# Altium schematic sheet CAN_IC.SchDoc
size A; SheetNumber: 8; SheetTotal: 8
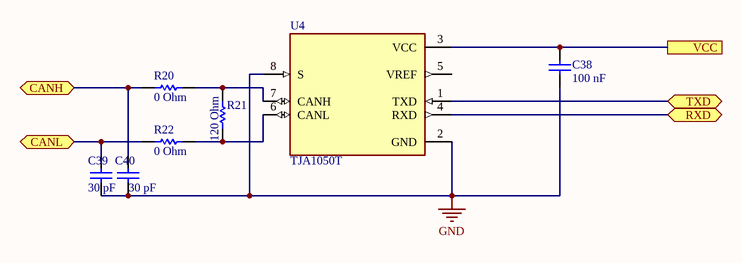
[diagram p0: CAN_IC.SchDoc]

## Parts
C38  100 nF  [CAP_0603]
C39  30 pF  [CAP_0603]
C40  30 pF  [CAP_0603]
R20  0 Ohm  [resistor_0603]
R21  120 Ohm  [resistor_0603]
R22  0 Ohm  [resistor_0603]
U4  TJA1050T  [SOIC127P600X175-8N]

## Ports
CANH (bidir, see MAIN_SENSOR[2A]), CANL (bidir, see MAIN_SENSOR[2A]), RXD (bidir, see MAIN_SENSOR[2A]), TXD (bidir, see MAIN_SENSOR[2A]), VCC (see MAIN_SENSOR[2A])

## Nets
GND: C38.2 C39.1 C40.1 U4.2(GND) U4.8(S)
CANH: C40.2 R20.1 ; port CANH
CANL: C39.2 R22.1 ; port CANL
RXD: U4.4(RXD) ; port RXD
TXD: U4.1(TXD) ; port TXD
VCC: C38.1 U4.3(VCC) ; port VCC
NetR20_2: R20.2 R21.2 U4.7(CANH)
NetR21_1: R21.1 R22.2 U4.6(CANL)

Not connected (* = marked no-connect by the designer): U4 5(VREF)

## Library data of the parts
C38 = 0106031041050: CAP, size 0603, 100 nF, 50 VDC; Manufacture Name: TDK; Manufacture SN: CGA3E3X8R1H104K080AE; Tolerance: +/-10%; Voltage Rating DC: 50 VDC; ComponentLink2Description: Datasheet; ComponentLink2URL: https://product.tdk.com/system/files/dam/doc/product/capacitor/ceramic/mlcc/catalog/mlcc_automotive_soft_en.pdf?ref_disty=mouser; Operating Temperature: -55 to +125degC; Packaging: Tape and Reel; Mounting Technology: SMT; Size: 0603; Capacitance: 100 nF; Supplier 1 Name: Mouser; Supplier 1 SN: 810-CGA3E3X8R1H104KA; Supplier 1 URL: https://www.mouser.com/ProductDetail/TDK/CGA3E3X8R1H104K080AE?qs=nQSIdc08i%252Bd8g3IRRgU2bw%3D%3D&utm_source=mouser-refine-download&utm_medium=file&utm_campaign=CGA3E3X8R1H104K080AE&utm_content=TDK; Supplier 2 Name: Digi-Key; Supplier 2 SN: 445-173697-2-ND; Supplier 2 URL: https://www.digikey.com/en/products/detail/tdk-corporation/cga3e3x8r1h104k080ae/5809262; Supplier 3 Name: thegioiic; Supplier 3 SN: N/A; Supplier 3 URL: N/A; Value: 100 nF, 50 VDC
C39 C40 = 0106033300550: CAP, size 0603, 33 pF, 50 VDC; Manufacture Name: TDK; Manufacture SN: CGA3E2NP01H330J080AA; Capacitance: 33 pF; Tolerance: +/-5%; Voltage Rating DC: 50 VDC; ComponentLink2Description: Datasheet; ComponentLink2URL: https://product.tdk.com/system/files/dam/doc/product/capacitor/ceramic/mlcc/catalog/mlcc_automotive_hightemp_en.pdf?ref_disty=mouser; Operating Temperature: -55 to +125degC; Packaging: Tape and Reel; Mounting Technology: SMT; Size: 0603; Supplier 1 Name: Mouser; Supplier 1 SN: 810-CGA3E2NP01H330JA; Supplier 1 URL: https://www.mouser.com/ProductDetail/TDK/CGA3E2NP01H330J080AA?qs=xLDY6iXSiQZLs28ZlT4aFg%3D%3D&utm_source=mouser-refine-download&utm_medium=file&utm_campaign=CGA3E2NP01H330J080AA&utm_content=TDK; Supplier 2 Name: Digi-Key; Supplier 2 SN: 445-12409-2-ND; Supplier 2 URL: https://www.digikey.com/en/products/detail/tdk-corporation/cga3e2np01h330j080aa/3949645; Supplier 3 Name: thegioiic; Supplier 3 SN: N/A; Supplier 3 URL: N/A; Value: 33 pF, 50 VDC
R20 R22 = 0006030001: RES, size 0603, 0 Ohm, 1/4 W; Manufacture  Name: YAGEO; Manufacture  SN: AC0603FR-070RL; Rated Power: 1/4 W; Resistance Tolerance: +/-1%; Resistance: 0 Ohm; Size: 0603; Mounting Technology: SMT; Supplier 1 Name: Mouser; Supplier 1 SN: 603-AC0603FR-070RL; Supplier 2 Name: Digi-Key; Supplier 2 SN: 311-0.0LDTR-ND; Supplier 1 URL: https://www.mouser.com/ProductDetail/YAGEO/AC0603FR-070RL?qs=sGAEpiMZZMtlubZbdhIBIOG3KwTtqrl%2FD2D%252BGuMCfoY%3D; Supplier 3 Name: thegioiic; Supplier 3 SN: N/A; Supplier 3 URL: https://www.thegioiic.com/dien-tro-0-ohm-0603-1-; Value: 0 Ohm, 1/4 W; ComponentLink1Description: Datasheet link; ComponentLink1URL: https://www.mouser.com/datasheet/2/447/Yageo_06282023_ACseries-3224032.pdf; ComponentLink2Description: Supplier 1 URL; ComponentLink2URL: N/A; ComponentLink3Description: Supplier 2 URL; ComponentLink3URL: https://www.digikey.com/en/products/detail/yageo/ac0603fr-070rl/2827812; ComponentLink4Description: Supplier 3 URL; ComponentLink4URL: N/A; Supplier 2 URL: https://www.digikey.com/en/products/detail/yageo/ac0603fr-070rl/2827812
R21 = 0006031211: RES, size 0603, 120 Ohm, 1/4 W; Manufacture  Name: OEM; Rated Power: 1/4 W; Resistance Tolerance: +/-1%; Resistance: 120 Ohm; Size: 0603; Mounting Technology: SMT; Supplier 1 Name: Mouser; Supplier 1 SN: 603-SR0603FR-7T120RL; Supplier 2 Name: Digi-Key; Supplier 2 SN: YAG5825TR-ND YAG5825CT-ND YAG5825DKR-ND; Supplier 1 URL: https://www.mouser.vn/ProductDetail/YAGEO/SR0603FR-7T120RL?qs=sGAEpiMZZMvdGkrng054tz1y1XEHv7sNpzSbq0ZWZmOggb8s%252BZMxlg%3D%3D; Supplier 3 Name: thegioiic; Supplier 3 SN: N/A; Supplier 3 URL: N/A; Manufacture  SN: OEM; Value: 120 Ohm, 1/4 W; ComponentLink1Description: Datasheet link; ComponentLink1URL: https://www.yageo.com/upload/media/product/productsearch/datasheet/rchip/PYu-SR_20105_RoHS_L_10.pdf; ComponentLink2Description: Supplier 1 URL; ComponentLink2URL: N/A; ComponentLink3Description: Supplier 2 URL; ComponentLink3URL: https://www.digikey.com/en/products/detail/yageo/SR0603FR-7T120RL/9373099; ComponentLink4Description: Supplier 3 URL; ComponentLink4URL: N/A; Supplier 2 URL: https://www.digikey.com/en/products/detail/yageo/SR0603FR-7T120RL/9373099
U4 = TJA1050T/CM,118: 1/1 Transceiver Half CANbus 8-SO; MF: NXP USA; SnapEDA_Link: https://www.snapeda.com/parts/TJA1050T/CM,118/NXP%20USA%20Inc./view-part/304529/?ref=snap; Value: *; Purchase-URL: https://pricing.snapeda.com/search/part/TJA1050T/CM,118/?ref=eda; Check_prices: https://www.snapeda.com/parts/TJA1050T/CM,118/NXP%20USA%20Inc./view-part/304529/?ref=eda; Price: None; Availability: In Stock; MP: TJA1050T/CM,118; Package: SO-8 NXP Semiconductors